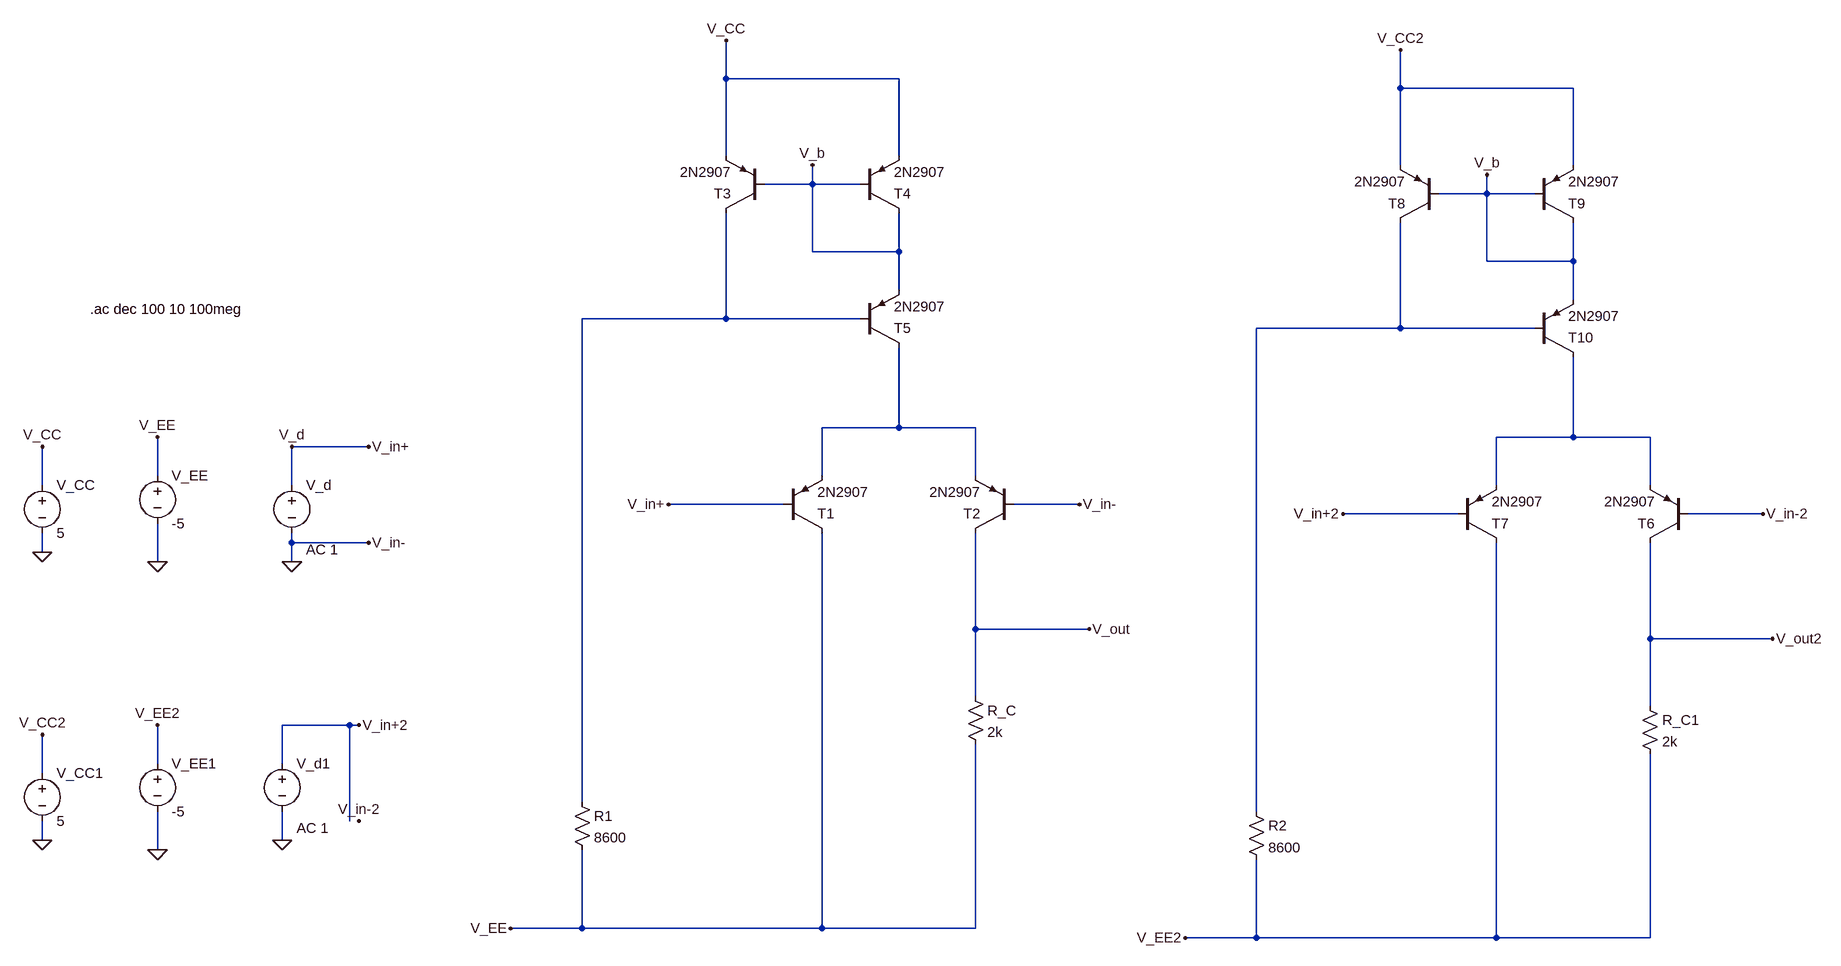
[diagram p0: schematic differential_amplifier_long_tailed_pair_finding_CMRR_vs_frequency.asc]
differential_amplifier_long_tailed_pair_finding_CMRR_vs_frequency.asc, the LTspice schematic file:
Version 4
SHEET 1 1716 1196
WIRE -400 -416 -400 -480
WIRE -112 -416 -400 -416
WIRE 896 -400 896 -464
WIRE 1184 -400 896 -400
WIRE -400 -288 -400 -416
WIRE -112 -288 -112 -416
WIRE 896 -272 896 -400
WIRE 1184 -272 1184 -400
WIRE -256 -240 -256 -272
WIRE -256 -240 -336 -240
WIRE -176 -240 -256 -240
WIRE 1040 -224 1040 -256
WIRE 1040 -224 960 -224
WIRE 1120 -224 1040 -224
WIRE -256 -128 -256 -240
WIRE -112 -128 -112 -192
WIRE -112 -128 -256 -128
WIRE 1040 -112 1040 -224
WIRE 1184 -112 1184 -176
WIRE 1184 -112 1040 -112
WIRE -112 -64 -112 -128
WIRE 1184 -48 1184 -112
WIRE -400 -16 -400 -192
WIRE -400 -16 -640 -16
WIRE -176 -16 -400 -16
WIRE 896 0 896 -176
WIRE 896 0 656 0
WIRE 1120 0 896 0
WIRE -112 272 -112 32
WIRE -112 272 -240 272
WIRE 16 272 -112 272
WIRE 1184 288 1184 48
WIRE 1184 288 1056 288
WIRE 1312 288 1184 288
WIRE -1056 304 -1184 304
WIRE -1408 352 -1408 288
WIRE -240 352 -240 272
WIRE 16 352 16 272
WIRE -1600 368 -1600 304
WIRE -1184 368 -1184 304
WIRE 1056 368 1056 288
WIRE 1312 368 1312 288
WIRE -304 400 -496 400
WIRE 304 400 80 400
WIRE 992 416 800 416
WIRE 1600 416 1376 416
WIRE -1184 464 -1184 448
WIRE -1056 464 -1184 464
WIRE -1600 480 -1600 448
WIRE -1408 496 -1408 432
WIRE -1184 496 -1184 464
WIRE 16 608 16 448
WIRE 320 608 16 608
WIRE 1312 624 1312 464
WIRE 1616 624 1312 624
WIRE 16 720 16 608
WIRE 1312 736 1312 624
WIRE -1088 768 -1200 768
WIRE -1072 768 -1088 768
WIRE -1408 832 -1408 768
WIRE -1200 832 -1200 768
WIRE -1600 848 -1600 784
WIRE -640 896 -640 -16
WIRE 656 912 656 0
WIRE -1088 928 -1088 768
WIRE -1600 960 -1600 928
WIRE -1200 960 -1200 912
WIRE -1408 976 -1408 912
WIRE -640 1120 -640 976
WIRE -640 1120 -816 1120
WIRE -240 1120 -240 448
WIRE -240 1120 -640 1120
WIRE 16 1120 16 800
WIRE 16 1120 -240 1120
WIRE 656 1136 656 992
WIRE 656 1136 480 1136
WIRE 1056 1136 1056 464
WIRE 1056 1136 656 1136
WIRE 1312 1136 1312 816
WIRE 1312 1136 1056 1136
FLAG -1600 480 0
FLAG -1408 496 0
FLAG -1184 496 0
FLAG -400 -480 V_CC
FLAG -256 -272 V_b
FLAG -1600 304 V_CC
FLAG -1408 288 V_EE
FLAG -816 1120 V_EE
FLAG -1184 304 V_d
FLAG -496 400 V_in+
FLAG 304 400 V_in-
FLAG 320 608 V_out
FLAG -1056 304 V_in+
FLAG -1056 464 V_in-
FLAG 896 -464 V_CC2
FLAG 1040 -256 V_b
FLAG 480 1136 V_EE2
FLAG 800 416 V_in+2
FLAG 1600 416 V_in-2
FLAG 1616 624 V_out2
FLAG -1600 960 0
FLAG -1408 976 0
FLAG -1600 784 V_CC2
FLAG -1408 768 V_EE2
FLAG -1200 960 0
FLAG -1072 768 V_in+2
FLAG -1072 928 V_in-2
SYMBOL voltage -1600 352 R0
WINDOW 123 0 0 Left 0
WINDOW 39 0 0 Left 0
SYMATTR InstName V_CC
SYMATTR Value 5
SYMBOL pnp 80 448 R180
SYMATTR InstName T2
SYMATTR Value 2N2907
SYMBOL pnp -304 448 M180
SYMATTR InstName T1
SYMATTR Value 2N2907
SYMBOL voltage -1408 336 R0
WINDOW 123 0 0 Left 0
WINDOW 39 0 0 Left 0
SYMATTR InstName V_EE
SYMATTR Value -5
SYMBOL voltage -1184 352 R0
WINDOW 123 24 124 Left 2
WINDOW 39 0 0 Left 0
SYMATTR Value2 AC 1
SYMATTR InstName V_d
SYMATTR Value ""
SYMBOL pnp -336 -192 R180
SYMATTR InstName T3
SYMATTR Value 2N2907
SYMBOL pnp -176 -192 M180
SYMATTR InstName T4
SYMATTR Value 2N2907
SYMBOL pnp -176 32 M180
SYMATTR InstName T5
SYMATTR Value 2N2907
SYMBOL res -656 880 R0
SYMATTR InstName R1
SYMATTR Value 8600
SYMBOL res 0 704 R0
SYMATTR InstName R_C
SYMATTR Value 2k
SYMBOL pnp 1376 464 R180
SYMATTR InstName T6
SYMATTR Value 2N2907
SYMBOL pnp 992 464 M180
SYMATTR InstName T7
SYMATTR Value 2N2907
SYMBOL pnp 960 -176 R180
SYMATTR InstName T8
SYMATTR Value 2N2907
SYMBOL pnp 1120 -176 M180
SYMATTR InstName T9
SYMATTR Value 2N2907
SYMBOL pnp 1120 48 M180
SYMATTR InstName T10
SYMATTR Value 2N2907
SYMBOL res 640 896 R0
SYMATTR InstName R2
SYMATTR Value 8600
SYMBOL res 1296 720 R0
SYMATTR InstName R_C1
SYMATTR Value 2k
SYMBOL voltage -1600 832 R0
WINDOW 123 0 0 Left 0
WINDOW 39 0 0 Left 0
SYMATTR InstName V_CC1
SYMATTR Value 5
SYMBOL voltage -1408 816 R0
WINDOW 123 0 0 Left 0
WINDOW 39 0 0 Left 0
SYMATTR InstName V_EE1
SYMATTR Value -5
SYMBOL voltage -1200 816 R0
WINDOW 123 24 124 Left 2
WINDOW 39 0 0 Left 0
SYMATTR Value2 AC 1
SYMATTR InstName V_d1
SYMATTR Value ""
TEXT -1520 -32 Left 2 !.ac dec 100 10 100meg

The netlist it stands for:
* differential_amplifier_long_tailed_pair_finding_CMRR_vs_frequency.asc
V_CC V_CC 0 5
Q§T2 V_out 0 N003 0 2N2907
Q§T1 V_EE V_in+ N003 0 2N2907
V_EE V_EE 0 -5
V_d V_in+ 0 AC 1
Q§T3 N001 V_b V_CC 0 2N2907
Q§T4 V_b V_b V_CC 0 2N2907
Q§T5 N003 N001 V_b 0 2N2907
R1 N001 V_EE 8600
R_C V_out V_EE 2k
Q§T6 V_out2 V_in-2 N004 0 2N2907
Q§T7 V_EE2 V_in+2 N004 0 2N2907
Q§T8 N002 V_b V_CC2 0 2N2907
Q§T9 V_b V_b V_CC2 0 2N2907
Q§T10 N004 N002 V_b 0 2N2907
R2 N002 V_EE2 8600
R_C1 V_out2 V_EE2 2k
V_CC1 V_CC2 0 5
V_EE1 V_EE2 0 -5
V_d1 V_in+2 0 AC 1
.model NPN NPN
.model PNP PNP
.lib standard.bjt
.ac dec 100 10 100meg
.backanno
.end